# EAGLE schematic generator_trikotniska (EAGLE 9.6.2)
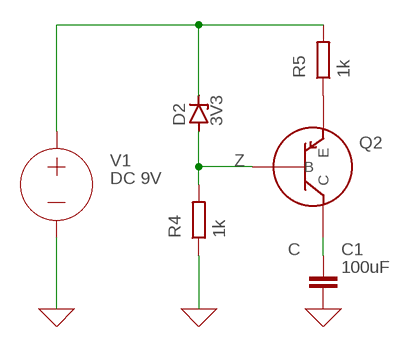
[diagram p0: schematic, sheet 1]

## Parts
C1  100uF  C  (no package)
D2  3V3  ZENER-DIODEZD-2.5  [ZDIO-2.5]
Q2  BJT_PNP  (no package)
R4  1k  R  (no package)
R5  1k  R  (no package)
V1  DC 9V  VOLTAGE  (no package)

## Nets
0: C1.2 R4.1 V1.- ; supply symbol labelled GND
C: C1.1 Q2.C
N$1: D2.C R5.2 V1.+
N$8: Q2.E R5.1
Z: D2.A Q2.B R4.2

## Library data of the parts
C1 = ngspice-simulation:C: CAPACITOR
D2 = diode:ZENER-DIODE: Z-Diode; SPICEMODEL: BZX84C3V3W; SPICEPREFIX: X
Q2 = ngspice-simulation:BJT_PNP: Bipolar PNP Transistor; SPICEMODEL: BC308B; SPICEPREFIX: Q
R4 R5 = ngspice-simulation:R: RESISTOR
V1 = ngspice-simulation:VOLTAGE: Independent Voltage Source, either DC, AC, PULSE, SINE, PWL, EXP, or SFFM; VALUE: 0V